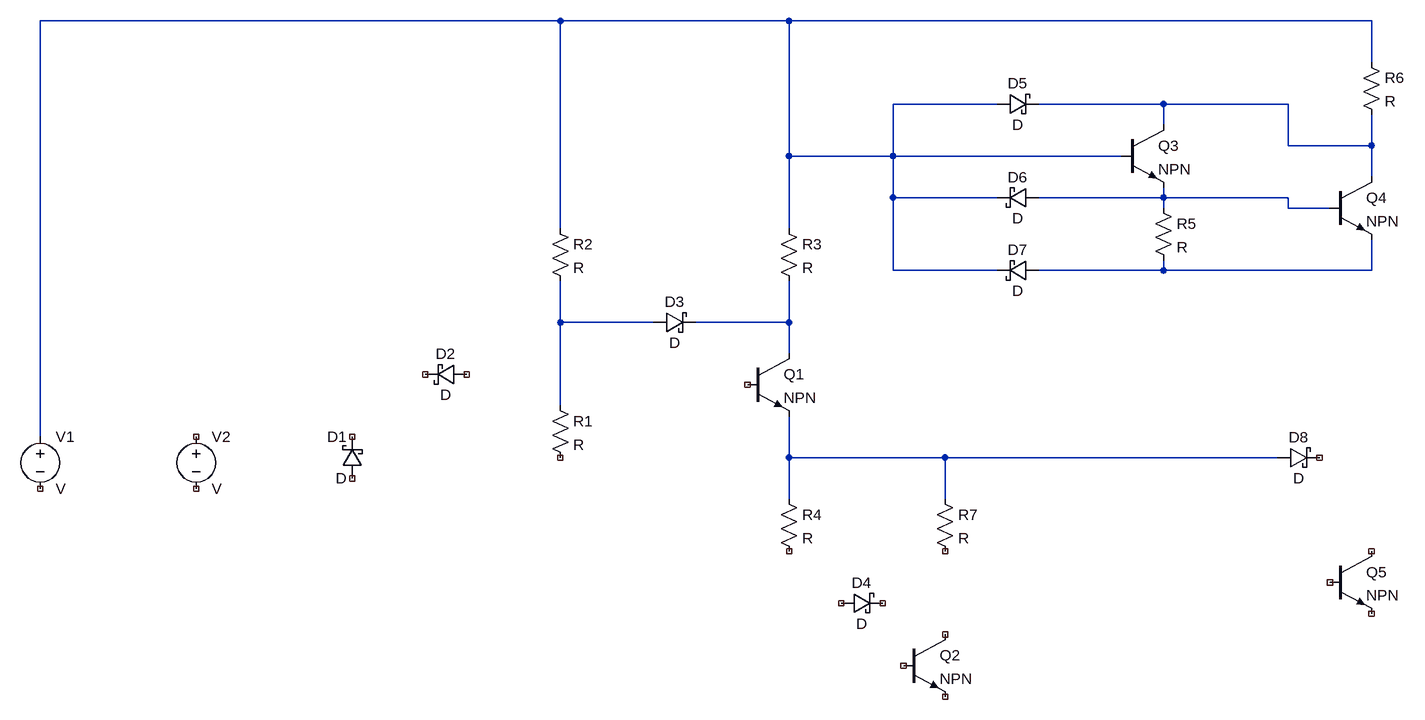
[diagram p0: schematic Draft1.asc]
Draft1.asc, the LTspice schematic file:
Version 4
SHEET 1 2008 680
WIRE 704 -512 -96 -512
WIRE 1056 -512 704 -512
WIRE 1952 -512 1056 -512
WIRE 1952 -448 1952 -512
WIRE 1376 -384 1216 -384
WIRE 1632 -384 1440 -384
WIRE 1824 -384 1632 -384
WIRE 1632 -352 1632 -384
WIRE 1824 -320 1824 -384
WIRE 1952 -320 1952 -368
WIRE 1952 -320 1824 -320
WIRE 1056 -304 1056 -512
WIRE 1216 -304 1216 -384
WIRE 1216 -304 1056 -304
WIRE 1568 -304 1216 -304
WIRE 1952 -272 1952 -320
WIRE 1216 -240 1216 -304
WIRE 1376 -240 1216 -240
WIRE 1632 -240 1632 -256
WIRE 1632 -240 1440 -240
WIRE 1824 -240 1632 -240
WIRE 1632 -224 1632 -240
WIRE 1824 -224 1824 -240
WIRE 1888 -224 1824 -224
WIRE 704 -192 704 -512
WIRE 1056 -192 1056 -304
WIRE 1216 -128 1216 -240
WIRE 1376 -128 1216 -128
WIRE 1632 -128 1632 -144
WIRE 1632 -128 1440 -128
WIRE 1952 -128 1952 -176
WIRE 1952 -128 1632 -128
WIRE 704 -48 704 -112
WIRE 848 -48 704 -48
WIRE 1056 -48 1056 -112
WIRE 1056 -48 912 -48
WIRE 1056 0 1056 -48
WIRE 704 80 704 -48
WIRE -96 128 -96 -512
WIRE 1056 160 1056 96
WIRE 1296 160 1056 160
WIRE 1808 160 1296 160
WIRE 1056 224 1056 160
WIRE 1296 224 1296 160
SYMBOL voltage -96 112 R0
SYMATTR InstName V1
SYMBOL voltage 144 112 R0
SYMATTR InstName V2
SYMBOL schottky 400 192 R180
WINDOW 0 24 64 Left 2
WINDOW 3 24 0 Left 2
SYMATTR InstName D1
SYMBOL schottky 560 16 R90
WINDOW 0 0 32 VBottom 2
WINDOW 3 32 32 VTop 2
SYMATTR InstName D2
SYMBOL res 688 64 R0
SYMATTR InstName R1
SYMBOL res 688 -208 R0
SYMATTR InstName R2
SYMBOL res 1040 -208 R0
SYMATTR InstName R3
SYMBOL schottky 848 -32 R270
WINDOW 0 32 32 VTop 2
WINDOW 3 0 32 VBottom 2
SYMATTR InstName D3
SYMBOL res 1040 208 R0
SYMATTR InstName R4
SYMBOL schottky 1136 400 R270
WINDOW 0 32 32 VTop 2
WINDOW 3 0 32 VBottom 2
SYMATTR InstName D4
SYMBOL schottky 1376 -368 R270
WINDOW 0 32 32 VTop 2
WINDOW 3 0 32 VBottom 2
SYMATTR InstName D5
SYMBOL schottky 1440 -256 R90
WINDOW 0 0 32 VBottom 2
WINDOW 3 32 32 VTop 2
SYMATTR InstName D6
SYMBOL schottky 1440 -144 R90
WINDOW 0 0 32 VBottom 2
WINDOW 3 32 32 VTop 2
SYMATTR InstName D7
SYMBOL res 1616 -240 R0
SYMATTR InstName R5
SYMBOL res 1936 -464 R0
SYMATTR InstName R6
SYMBOL schottky 1808 176 R270
WINDOW 0 32 32 VTop 2
WINDOW 3 0 32 VBottom 2
SYMATTR InstName D8
SYMBOL npn 992 0 R0
SYMATTR InstName Q1
SYMBOL npn 1232 432 R0
SYMATTR InstName Q2
SYMBOL npn 1568 -352 R0
SYMATTR InstName Q3
SYMBOL npn 1888 -272 R0
SYMATTR InstName Q4
SYMBOL npn 1888 304 R0
SYMATTR InstName Q5
SYMBOL res 1280 208 R0
SYMATTR InstName R7

The netlist it stands for:
* Draft1.asc
V1 N001 NC_01 V
V2 NC_02 NC_03 V
D1 NC_04 NC_05 D
D2 NC_06 NC_07 D
R1 N005 NC_08 R
R2 N001 N005 R
R3 N001 N006 R
D3 N005 N006 D
R4 N007 NC_09 R
D4 NC_10 NC_11 D
D5 N001 N002 D
D6 N003 N001 D
D7 N004 N001 D
R5 N003 N004 R
R6 N001 N002 R
D8 N007 NC_12 D
Q1 N006 NC_13 N007 0 NPN
Q2 NC_14 NC_15 NC_16 0 NPN
Q3 N002 N001 N003 0 NPN
Q4 N002 N003 N004 0 NPN
Q5 NC_17 NC_18 NC_19 0 NPN
R7 N007 NC_20 R
.model D D
.lib standard.dio
.model NPN NPN
.model PNP PNP
.lib standard.bjt
.backanno
.end